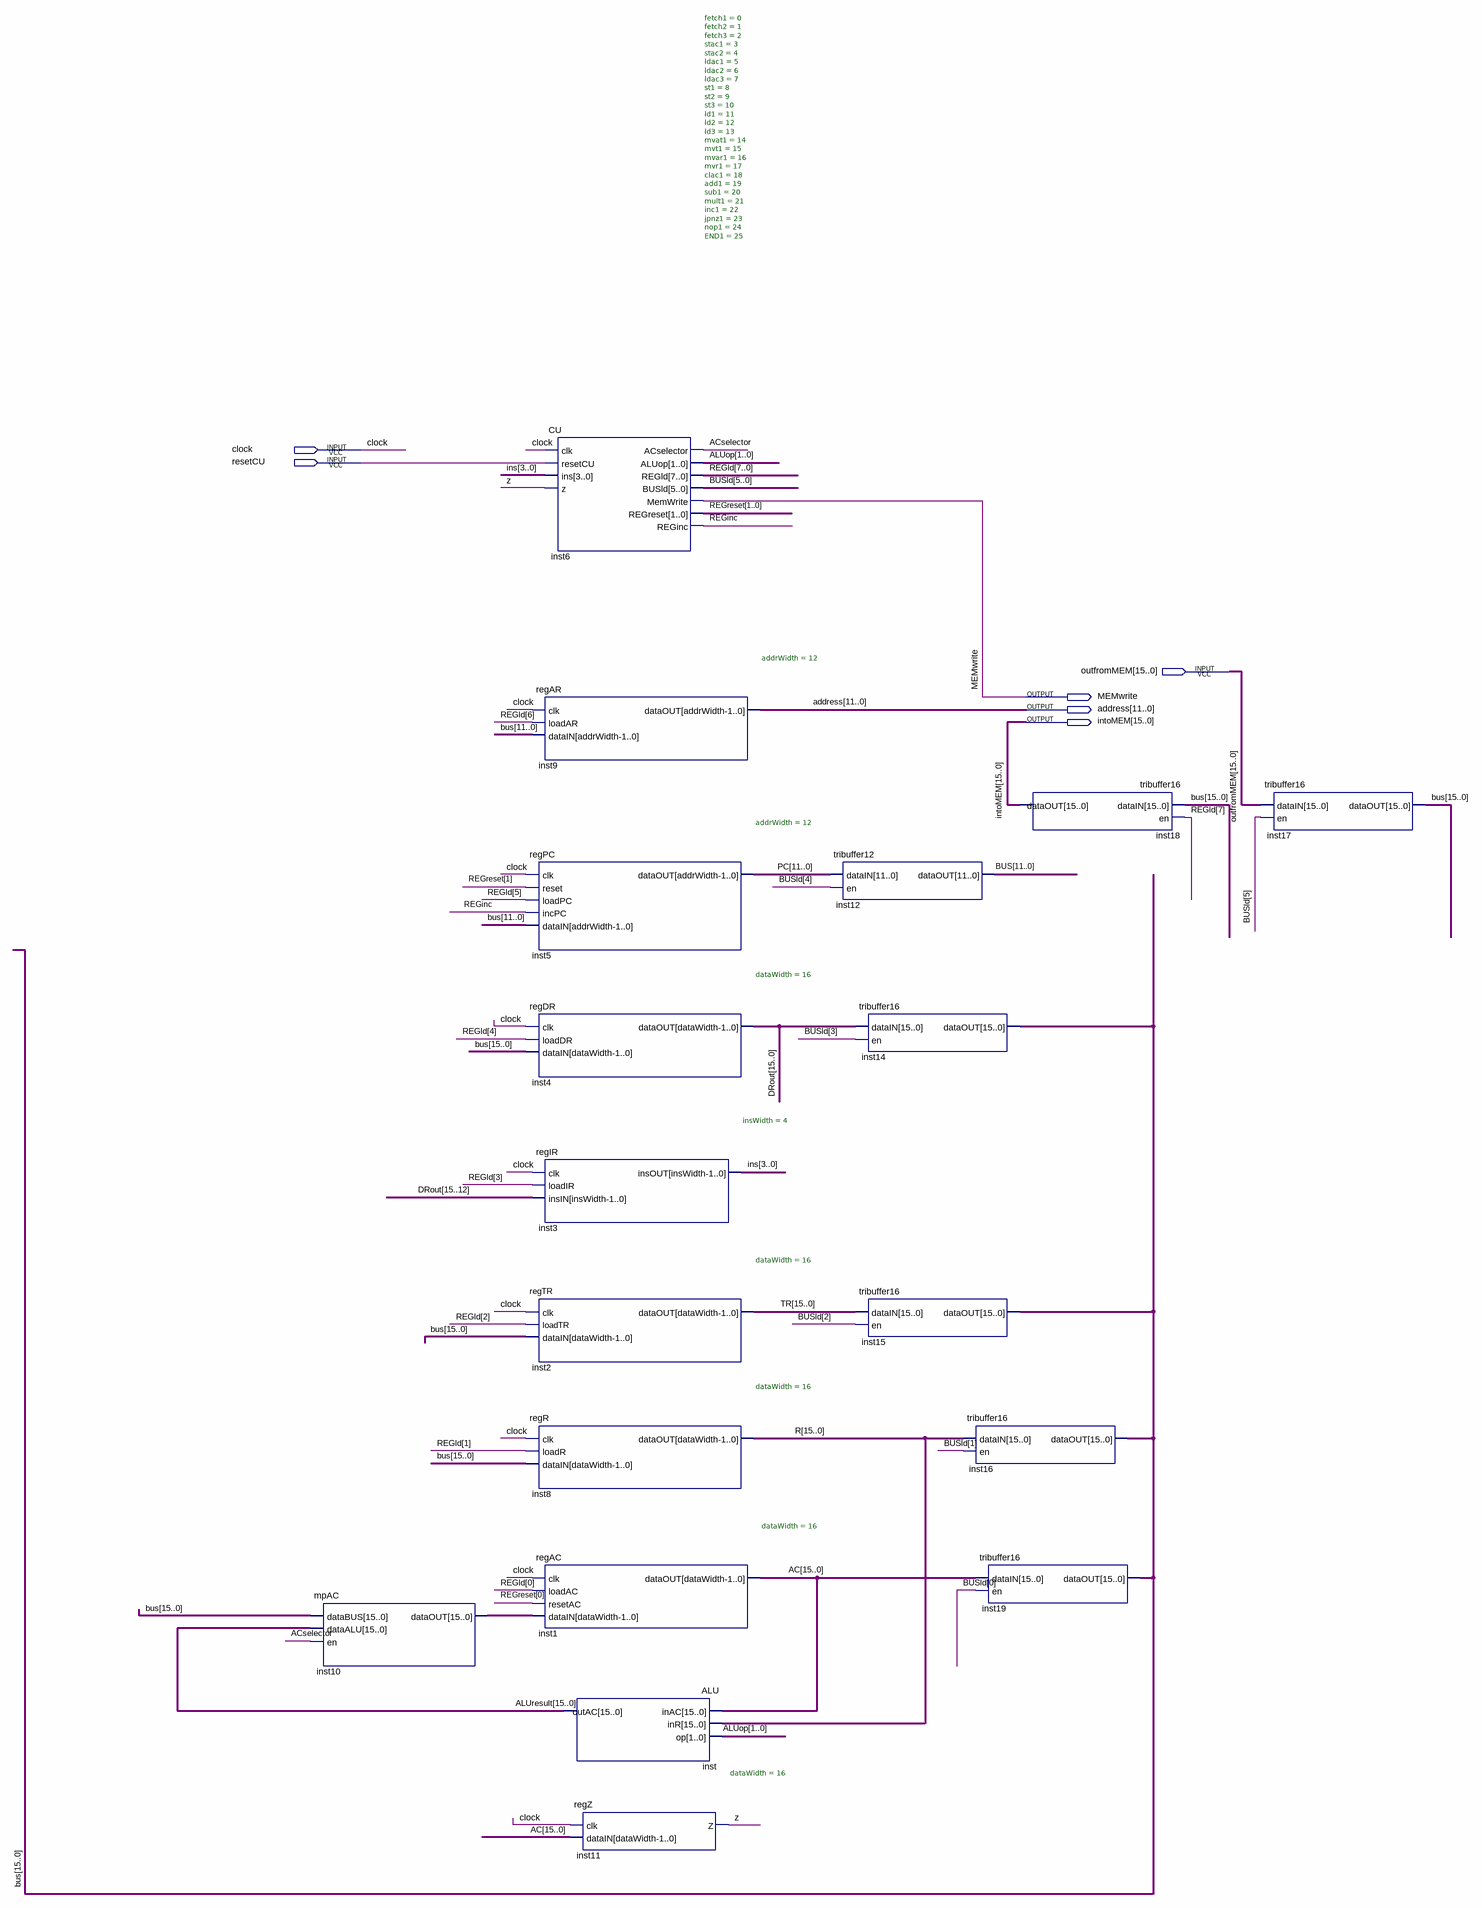
[diagram p0: schematic sheet]
// Quartus schematic singlecore.bdf as structural Verilog: 18 symbols, 6 pins
module singlecore (
  input  clock,
  input  resetCU,
  input  [15:0] outfromMEM,
  output MEMwrite,
  output [11:0] address,
  output [15:0] intoMEM
);

  wire ACselector, REGinc, z;
  wire [1:0] ALUop, REGreset;
  wire [3:0] ins;
  wire [5:0] BUSld;
  wire [7:0] REGld;
  wire [11:0] PC;
  wire [15:0] AC, ALUresult, bus, DRout, inst10_dataout, R, TR;

  mpAC inst10 (.dataBUS(bus), .dataALU(ALUresult), .en(ACselector), .dataOUT(inst10_dataout));
  regAR #(.addrWidth(12)) inst9 (.clk(clock), .loadAR(REGld[6]), .dataIN(bus[11:0]), .dataOUT(address));
  regPC #(.addrWidth(12)) inst5 (
    .clk(clock), .reset(REGreset[1]), .loadPC(REGld[5]), .incPC(REGinc), .dataIN(bus[11:0]), .dataOUT(PC));
  regDR #(.dataWidth(16)) inst4 (.clk(clock), .loadDR(REGld[4]), .dataIN(bus), .dataOUT(DRout));
  regIR #(.insWidth(4)) inst3 (.clk(clock), .loadIR(REGld[3]), .insIN(DRout[15:12]), .insOUT(ins));
  regTR #(.dataWidth(16)) inst2 (.clk(clock), .loadTR(REGld[2]), .dataIN(bus), .dataOUT(TR));
  regR #(.dataWidth(16)) inst8 (.clk(clock), .loadR(REGld[1]), .dataIN(bus), .dataOUT(R));
  regAC #(.dataWidth(16)) inst1 (
    .clk(clock), .loadAC(REGld[0]), .resetAC(REGreset[0]), .dataIN(inst10_dataout), .dataOUT(AC));
  CU #(.fetch1(0), .fetch2(1), .fetch3(2), .stac1(3), .stac2(4), .ldac1(5), .ldac2(6), .ldac3(7), .st1(8), .st2(9), .st3(10), .ld1(11), .ld2(12), .ld3(13), .mvat1(14), .mvt1(15), .mvar1(16), .mvr1(17), .clac1(18), .add1(19), .sub1(20), .mult1(21), .inc1(22), .jpnz1(23), .nop1(24), .END1(25)) inst6 (
    .clk(clock), .resetCU(resetCU), .ins(ins), .z(z), .ACselector(ACselector), .ALUop(ALUop), .REGld(REGld),
    .BUSld(BUSld), .MemWrite(MEMwrite), .REGreset(REGreset), .REGinc(REGinc));
  ALU inst (.inAC(AC), .inR(R), .op(ALUop), .outAC(ALUresult));
  regZ #(.dataWidth(16)) inst11 (.clk(clock), .dataIN(AC), .Z(z));
  tribuffer12 inst12 (.dataIN(PC), .en(BUSld[4]), .dataOUT(bus[11:0]));
  tribuffer16 inst14 (.dataIN(DRout), .en(BUSld[3]), .dataOUT(bus));
  tribuffer16 inst15 (.dataIN(TR), .en(BUSld[2]), .dataOUT(bus));
  tribuffer16 inst16 (.dataIN(R), .en(BUSld[1]), .dataOUT(bus));
  tribuffer16 inst19 (.dataIN(AC), .en(BUSld[0]), .dataOUT(bus));
  tribuffer16 inst18 (.dataIN(bus), .en(REGld[7]), .dataOUT(intoMEM));
  tribuffer16 inst17 (.dataIN(outfromMEM), .en(BUSld[5]), .dataOUT(bus));
endmodule
